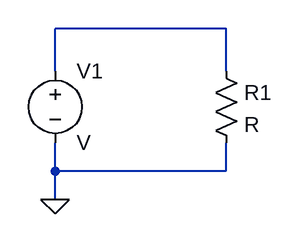
[diagram p0: schematic Importing_WAV.asc]
Importing_WAV.asc, the LTspice schematic file:
Version 4
SHEET 1 880 680
WIRE 224 80 32 80
WIRE 32 128 32 80
WIRE 224 128 224 80
WIRE 32 240 32 208
WIRE 224 240 224 208
WIRE 224 240 32 240
WIRE 32 272 32 240
FLAG 32 272 0
SYMBOL voltage 32 112 R0
SYMATTR InstName V1
SYMBOL res 208 112 R0
SYMATTR InstName R1

The netlist it stands for:
* Importing_WAV.asc
V1 N001 0 V
R1 N001 0 R
.backanno
.end